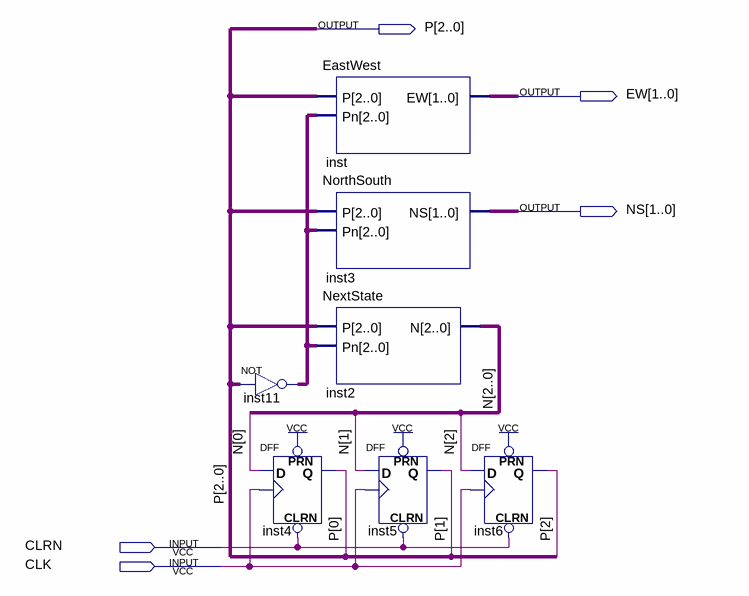
[diagram p0: schematic sheet]
// Quartus schematic TrafficLight.bdf as structural Verilog: 7 symbols, 5 pins
module TrafficLight (
  input  CLRN,
  input  CLK,
  output [2:0] P,
  output [1:0] EW,
  output [1:0] NS
);

  wire [2:0] inst11_out, N;

  assign inst11_out = ~P;  // NOT inst11, 3 bits wide
  DFF inst4 (.CLRN(CLRN), .CLK(CLK), .D(N[0]), .PRN(1'b1), .Q(P[0]));
  EastWest inst (.P(P), .Pn(inst11_out), .EW(EW));
  NorthSouth inst3 (.P(P), .Pn(inst11_out), .NS(NS));
  NextState inst2 (.P(P), .Pn(inst11_out), .N(N));
  DFF inst5 (.CLRN(CLRN), .CLK(CLK), .D(N[1]), .PRN(1'b1), .Q(P[1]));
  DFF inst6 (.CLRN(CLRN), .CLK(CLK), .D(N[2]), .PRN(1'b1), .Q(P[2]));
endmodule
